# Altium schematic sheet Bi directional ESD diode.schdoc
size 127 x 101 mm
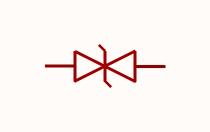
[diagram p0: Bi directional ESD diode.schdoc]

## Parts
D?  SDD32C24L01  [SOD-323_L1.7-W1.3-LS2.5-BI]  (value not drawn)

## Nets

Not connected (* = marked no-connect by the designer): D? 1 2

## Library data of the parts
D? = SDD32C24L01: Manufacturer: Brightking(君耀电子); Add into BOM: yes; polarity: Bi-Directional; Reverse Stand-Off Voltage (Vrwm): 24V; Maximum Clamping Voltage: 43V; Peak Pulse Current (Ipp)@10/1000us: 1A; Breakdown Voltage: 26.7V; Number of Lines: 单路; Type: ESD; Symbol: SDD32C24L01; Device: SDD32C24L01; LCSC Part Name: 双向ESD; Supplier Part: C313315; Manufacturer Part: SDD32C24L01; Supplier Footprint: SOD-323; JLCPCB Part Class: Extended Part; Datasheet: https://atta.szlcsc.com/upload/public/pdf/source/20181015/C313315_2E77C22BCD6B5C9557E0D87DB90BD0FE.pdf; Supplier: LCSC; Convert to PCB: yes